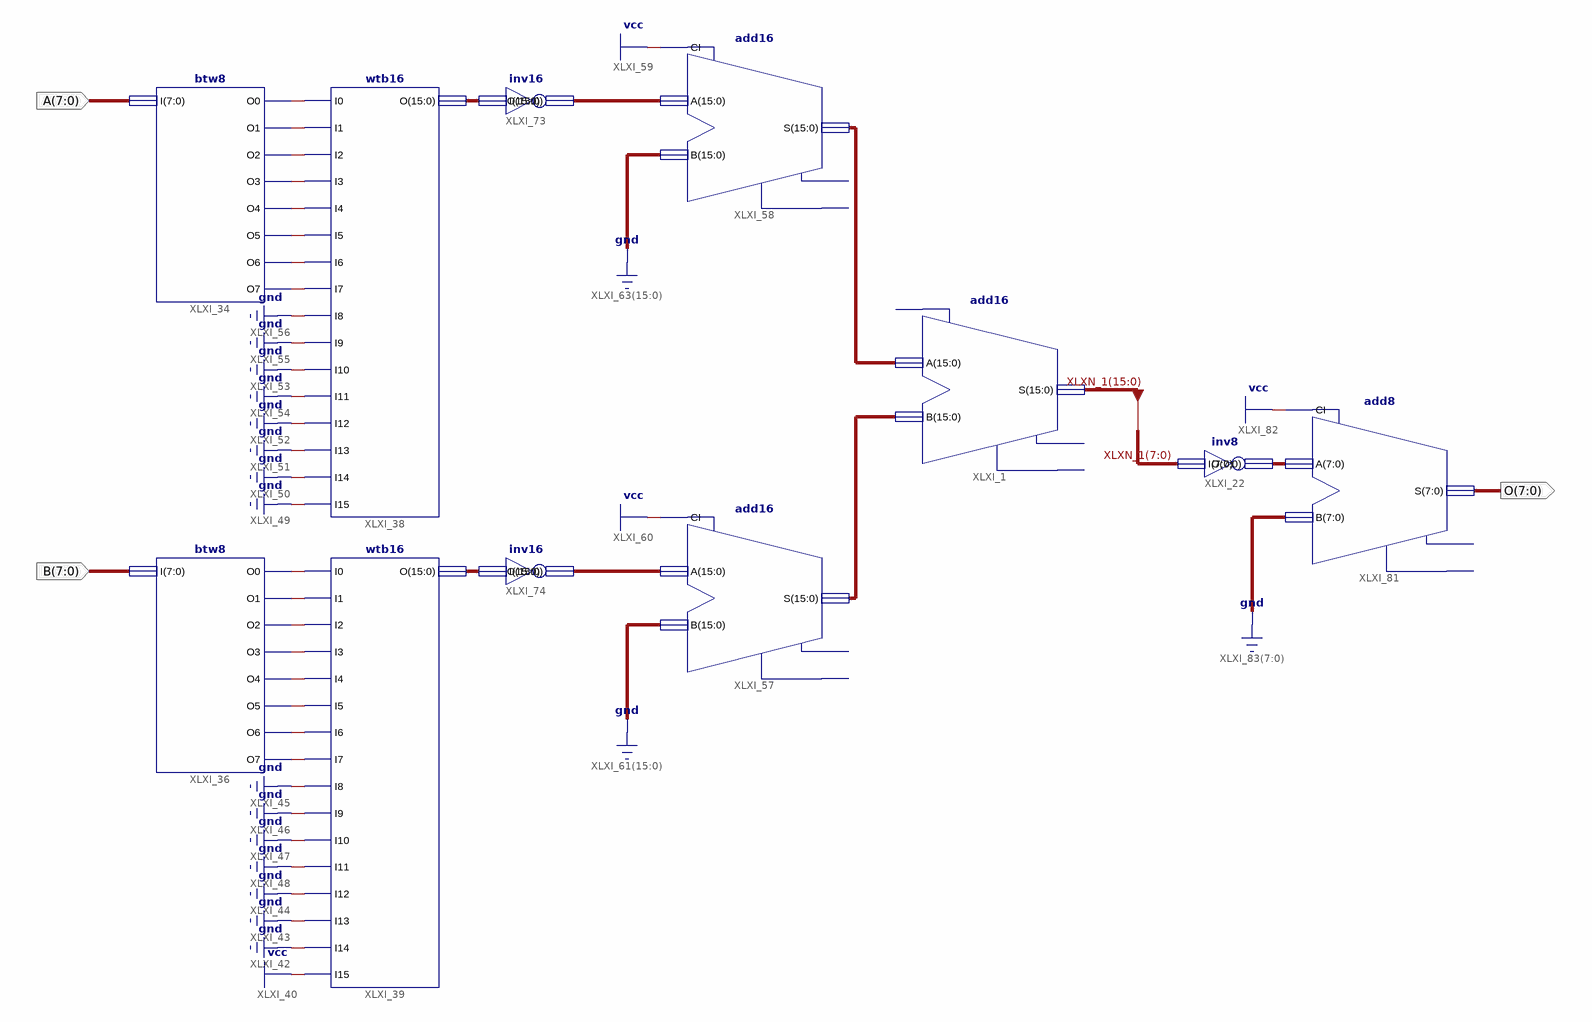
[diagram p0: schematic sheet 1]
// Xilinx ISE schematic sub8.sch (spartan6) as structural Verilog: 11 symbols, 3 ports
module sub8 (
  input  [7:0] A,
  input  [7:0] B,
  output [7:0] O
);

  wire XLXN_84, XLXN_85, XLXN_86, XLXN_87, XLXN_88, XLXN_89, XLXN_90, XLXN_91, XLXN_92, XLXN_93, XLXN_94,
       XLXN_95, XLXN_96, XLXN_97, XLXN_98, XLXN_99;
  wire [7:0] XLXN_152;
  wire [15:0] XLXN_1, XLXN_134, XLXN_135, XLXN_136, XLXN_137, XLXN_138, XLXN_139;

  btw8 XLXI_34 (
    .I(A), .O0(XLXN_84), .O1(XLXN_85), .O2(XLXN_86), .O3(XLXN_87), .O4(XLXN_88), .O5(XLXN_89), .O6(XLXN_90),
    .O7(XLXN_91));
  btw8 XLXI_36 (
    .I(B), .O0(XLXN_92), .O1(XLXN_93), .O2(XLXN_94), .O3(XLXN_95), .O4(XLXN_96), .O5(XLXN_97), .O6(XLXN_98),
    .O7(XLXN_99));
  wtb16 XLXI_38 (
    .I0(XLXN_84), .I1(XLXN_85), .I2(XLXN_86), .I3(XLXN_87), .I4(XLXN_88), .I5(XLXN_89), .I6(XLXN_90),
    .I7(XLXN_91), .I8(1'b0), .I9(1'b0), .I10(1'b0), .I11(1'b0), .I12(1'b0), .I13(1'b0), .I14(1'b0),
    .I15(1'b0), .O(XLXN_134));
  wtb16 XLXI_39 (
    .I0(XLXN_92), .I1(XLXN_93), .I2(XLXN_94), .I3(XLXN_95), .I4(XLXN_96), .I5(XLXN_97), .I6(XLXN_98),
    .I7(XLXN_99), .I8(1'b0), .I9(1'b0), .I10(1'b0), .I11(1'b0), .I12(1'b0), .I13(1'b0), .I14(1'b0),
    .I15(1'b1), .O(XLXN_135));
  add16 XLXI_57 (.A(XLXN_137), .B({16{1'b0}}), .CI(1'b1), .S(XLXN_138));  // open: CO, OFL
  add16 XLXI_58 (.A(XLXN_136), .B({16{1'b0}}), .CI(1'b1), .S(XLXN_139));  // open: CO, OFL
  inv16 XLXI_73 (.I(XLXN_134), .O(XLXN_136));
  inv16 XLXI_74 (.I(XLXN_135), .O(XLXN_137));
  inv8 XLXI_22 (.I(XLXN_1[7:0]), .O(XLXN_152));
  add16 XLXI_1 (.A(XLXN_139), .B(XLXN_138), .S(XLXN_1));  // open: CI, CO, OFL
  add8 XLXI_81 (.A(XLXN_152), .B({8{1'b0}}), .CI(1'b1), .S(O));  // open: CO, OFL
endmodule
